# Altium schematic sheet DoorNode.SchDoc: Tool Armoury Door
size A4; DrawnBy: Luke Hovington; Organization: HSBNE; DocumentNumber: 1; Revision: 2; SheetNumber: 1; SheetTotal: 1; PageSetup: Record=PageOptions|CenterHorizontal=True|CenterVertical=True|PrintScale=1.00|XCorrection=1.00|YCorrection=1.00|PrintKind=1|BorderSize=5000000|LeftOffset=0|BottomOffset=0|Orientation=2|PaperLength=1000|PaperWidth=1000|Scale=100|PaperSource=7|PrintQuality=-3|MediaType=1|DitherType=10|PrintScaleMode=1|PaperKind=Letter; ProjectName: Tool Armoury Door
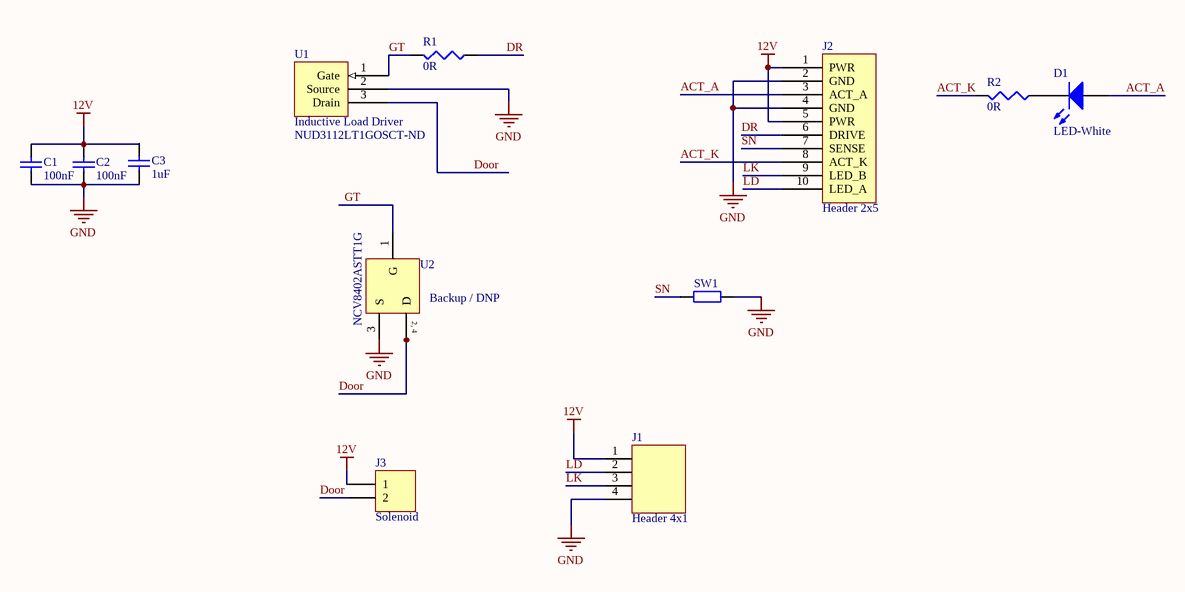
[diagram p0: DoorNode.SchDoc]

## Parts
C1  100nF  [C1206]
C2  100nF  [C1206]
C3  1uF  [C1206]
D1  LED-White  [STW8Q14]
J1  Header 4x1  [4x1]
J2  Header 2x5  [2x5]
J3  Solenoid  [JST-XH]
R1  0R  [C1206]
R2  0R  [C1206]
SW1  Switch  [ReedSwitch]  (value not drawn)
U1  Inductive Load Driver  Supplier Part Number 1: NUD3112LT1GOSCT-ND  [SOT-23]
U2  NCV8402ASTT1G  [ONSC-SOT-223-4-318E-04_V]

## Nets
12V: C1.2 C2.2 C3.2 J1.1 J2.1(PWR) J2.5(PWR) J3.1
GND: C1.1 C2.1 C3.1 J1.4 J2.2(GND) J2.4(GND) SW1.1 U1.2(Source) U2.3(S)
ACT_A: D1.2(A) J2.3(ACT_A)
ACT_K: J2.8(ACT_K) R2.2
Door: J3.2 U1.3(Drain) U2.2(D) U2.4(D)
DR: J2.6(DRIVE) R1.1
GT: R1.2 U1.1(Gate) U2.1(G)
LD: J1.2 J2.10(LED_A)
LK: J1.3 J2.9(LED_B)
SN: J2.7(SENSE) SW1.2
NetD1_1: D1.1(K) R2.1

## Notes on the sheet
- (near U2) Backup / DNP
- (in symbol CMP-1069-00019-1) 2, 4

## Library data of the parts
C1 C2 = Cap 100nF: Capacitor (Semiconductor SIM Model); Published: 8-Jun-2000; LatestRevisionDate: 29-May-2009; LatestRevisionNote: IPC-7351 Footprint Added.; PackageReference: C1206; Publisher: Altium Limited; PackageDescription: Chip Capacitor; Value: 100nF; Supplier 1: Digi-Key; Supplier 2: Mouser; Supplier Part Number 1: 399-1249-1-ND; Supplier Part Number 2: 80-C1206C104K5R
C3 = Cap 1uF: Capacitor (Semiconductor SIM Model); Published: 8-Jun-2000; LatestRevisionDate: 29-May-2009; LatestRevisionNote: IPC-7351 Footprint Added.; PackageReference: C1206; Publisher: Altium Limited; PackageDescription: Chip Capacitor; Value: 1uF; Supplier 1: Mouser; Supplier 2: Digi-Key; Supplier Part Number 1: 80-C1206C105K5R; Supplier Part Number 2: 399-8150-1-ND
D1 = LED-White: White; Published: 8-Jun-2000; LatestRevisionDate: 17-Jul-2002; LatestRevisionNote: Re-released for DXP Platform.; PackageVersion: Feb-2002; PackageReference: 3.2X1.6X1.1; Publisher: Altium Limited; PackageDescription: SM LED; 2 Flat Leads; Supplier 1: Digi-Key; Supplier Part Number 1: STW8Q14BE-T0,T5,U0,U7-ET-PCK-ND; Supplier 2: Digi-Key; Supplier Part Number 2: STW8Q14C-U7V5-DA-SPT-ND
J2 = Header 2x5a: Header
J3 = Header 2 JST-XH: Header, 2-Pin; LatestRevisionDate: 17-Jul-2002; LatestRevisionNote: Re-released for DXP Platform.; Publisher: Altium Limited; Supplier 1: Digi-Key; Supplier Part Number 1: 455-2247-ND
R1 R2 = Resistor-10K: Resistor; Value: 10K; Published: 8-Jun-2000; LatestRevisionDate: 29-May-2009; LatestRevisionNote: IPC-7351 Footprint Added.; PackageReference: J1-0603; Publisher: Altium Limited; PackageDescription: Chip Resistor; Supplier 1: Digi-Key; Supplier 2: Mouser; Supplier Part Number 1: P10KECT-ND; Supplier Part Number 2: 71-CRCW1206-10K-E3
SW1 = Switch: ReedSwitch; Published: 8-Jun-2000; LatestRevisionDate: 17-Jul-2002; LatestRevisionNote: Re-released for DXP Platform.; PackageReference: AXIAL-0.4; Publisher: Altium Limited; PackageDescription: Axial Device, Thru-Hole; 2 Leads; 0.4 in Pin Spacing
U1 = NUD3112: Integrated Relay,  Inductive Load Driver; Supplier 1: Digi-Key
U2 = CMP-1069-00019-1: Self-Protected Low Side Driver with Temperature and Current Limit, 4-Pin SOT-223, Pb-Free, Tape and Reel; Manufacturer: On Semiconductor; Channel Polarity: N Channel; ComponentLink3Description: Package Specification; Packing: Tape and Reel; ComponentLink3URL: http://www.onsemi.com/pub_link/Collateral/318E-04.PDF; ComponentLink1URL: http://www.onsemi.com/; PartNumber: NCV8402ASTT1G; PackageDescription: 4-Pin Small Outline Transistor, Body 6.5 x 3.5 mm, Pitch 2.3 mm; DatasheetVersion: Rev. 8; ComponentLink1Description: Manufacturer URL; Mounting Technology: Surface Mount; PackageVersion: Rev. N, 08/2009; PackageReference: SOT-223-4-318E-04; ComponentLink2URL: http://www.onsemi.com/pub_link/Collateral/NCV8402-D.PDF; ComponentLink2Description: Datasheet; RoHS: Pb-Free
J1 = Header 4x1: LatestRevisionDate: 17-Jul-2002; LatestRevisionNote: Re-released for DXP Platform.; Publisher: Altium Limited